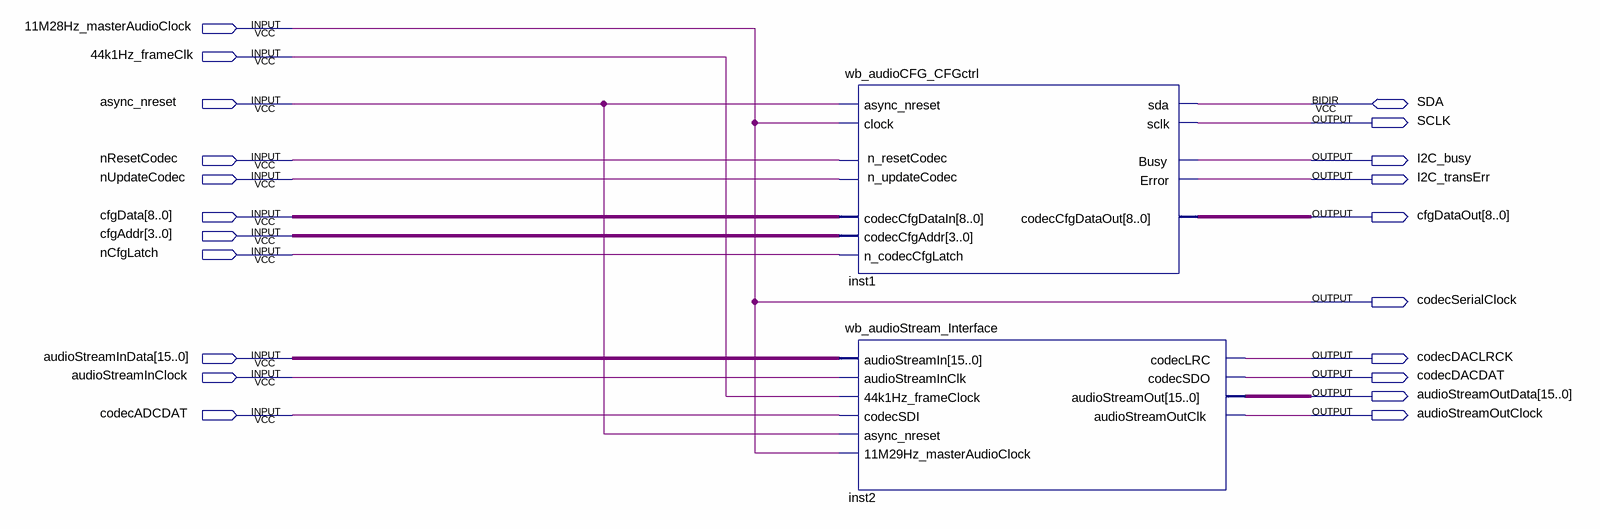
[diagram p0: schematic sheet]
// Quartus schematic wb_audio_BasicInterface.bdf as structural Verilog: 2 symbols, 21 pins
module wb_audio_BasicInterface (
  input  \11M28Hz_masterAudioClock ,
  input  \44k1Hz_frameClk ,
  input  async_nreset,
  input  nResetCodec,
  input  nUpdateCodec,
  input  [8:0] cfgData,
  input  [3:0] cfgAddr,
  input  nCfgLatch,
  input  [15:0] audioStreamInData,
  input  audioStreamInClock,
  input  codecADCDAT,
  inout  SDA,
  output SCLK,
  output I2C_busy,
  output I2C_transErr,
  output [8:0] cfgDataOut,
  output codecSerialClock,
  output codecDACLRCK,
  output codecDACDAT,
  output [15:0] audioStreamOutData,
  output audioStreamOutClock
);

  wb_audioCFG_CFGctrl inst1 (
    .n_resetCodec(nResetCodec), .n_updateCodec(nUpdateCodec), .async_nreset(async_nreset),
    .clock(\11M28Hz_masterAudioClock ), .codecCfgDataIn(cfgData), .codecCfgAddr(cfgAddr),
    .n_codecCfgLatch(nCfgLatch), .Busy(I2C_busy), .Error(I2C_transErr), .sclk(SCLK),
    .codecCfgDataOut(cfgDataOut), .sda(SDA));
  wb_audioStream_Interface inst2 (
    .codecSDI(codecADCDAT), .audioStreamIn(audioStreamInData), .audioStreamInClk(audioStreamInClock),
    .\44k1Hz_frameClock (\44k1Hz_frameClk ), .async_nreset(async_nreset),
    .\11M29Hz_masterAudioClock (\11M28Hz_masterAudioClock ), .codecSDO(codecDACDAT),
    .audioStreamOut(audioStreamOutData), .audioStreamOutClk(audioStreamOutClock), .codecLRC(codecDACLRCK));

  assign codecSerialClock = \11M28Hz_masterAudioClock ;
endmodule
